# Altium schematic sheet TC1508.SchDoc
size A4; SheetNumber: 2; SheetTotal: 3
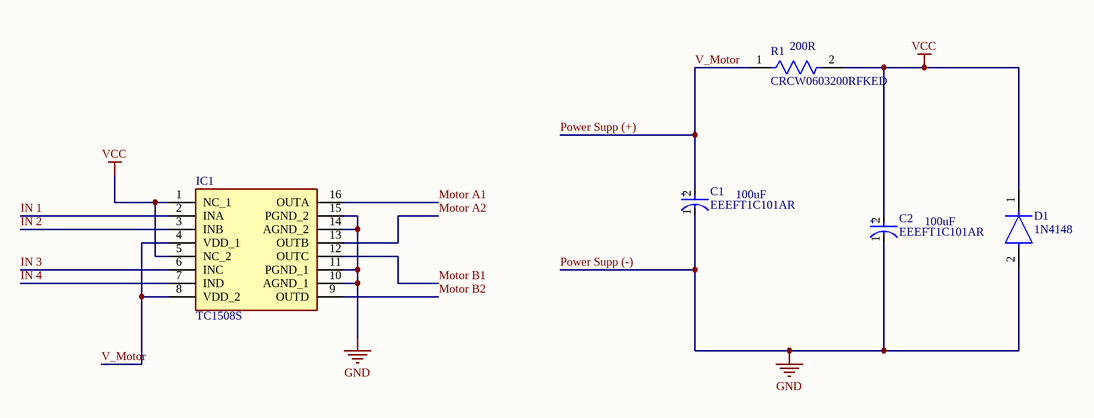
[diagram p0: TC1508.SchDoc]

## Parts
C1  EEEFT1C101AR  Capacitance: 100uF  [FP-FTC-MFG]
C2  EEEFT1C101AR  Capacitance: 100uF  [FP-FTC-MFG]
D1  1N4148  [FP-017AG-MFG]
IC1  TC1508S  [SOIC127P600X180-16N]
R1  CRCW0603200RFKED  Resistance: 200R  [FP-CRCW0603-e3-MFG]

## Nets
Power Supp (-): C1.1(C) C2.1(C) D1.2(A) IC1.10(AGND_1) IC1.11(PGND_1) IC1.14(AGND_2) IC1.15(PGND_2)  [also labelled GND]
VCC: C2.2(A) D1.1(C) IC1.1(NC_1) IC1.5(NC_2) R1.2
IN 1: IC1.2(INA)
IN 2: IC1.3(INB)
IN 3: IC1.6(INC)
IN 4: IC1.7(IND)
Motor A1: IC1.16(OUTA)
Motor A2: IC1.13(OUTB)
Motor B1: IC1.12(OUTC)
Motor B2: IC1.9(OUTD)
Power Supp (+): C1.2(A) IC1.4(VDD_1) IC1.8(VDD_2) R1.1  [also labelled V_Motor]

## Notes on the sheet
- (in symbol CMP-05427-000077-1) +

## Library data of the parts
C1 C2 = CMP-05427-000077-1: CAP ALUM 100UF 20% 16V SMD; Life (Hours): 2000Hour; Ripple Current: 240mA; Leakage Current: 16uA; Lead Diameter: 0.65mm; ESR (Equivalent Series Resistance): 360mR; Voltage Rating: 16V; Lead Pitch: 1.5mm; RoHS Compliant: Yes; Mount: Surface Mount; Tolerance: 20%; Contact Plating: Tin; Length: 5.8mm; Voltage: 16V; REACH SVHC: No SVHC; Max Operating Temperature: 105°C; Series: FT; Min Operating Temperature: -55°C; Diameter: 5mm; Case/Package: Radial; Radiation Hardening: No; Height - Seated (Max): 0.24inch; Construction: Cylindrical; Packaging: Tape and Reel; Voltage Rating (DC): 16V; Termination: SMD/SMT; Package Quantity: 1000; Ripple Current (AC): 240mA; Height: 5.8mm
D1 = CMP-07163-000046-1: DIODE GEN PURP 100V 200MA DO35; Forward Voltage: 1V; Max Power Dissipation: 500mW; Max Reverse Current: 5uA; Forward Current: 300mA; Current: 4A; Reverse Recovery Time: 4ns; Element Configuration: Single; Outside Diameter: 1.85mm; Capacitance: 4pF; Polarity: Standard; Max Forward Surge Current (Ifsm): 1A; Reverse Voltage: 100V; Output Current: 200mA; Average Rectified Current: 200mA; Diameter: 1.91mm; Max Repetitive Reverse Voltage (Vrrm): 100V; Current Rating: 200mA; Case/Package: DO-35; Lead Free: Lead Free; Number of Pins: 2; Recovery Time: 4ns; Packaging: Bulk; Contact Plating: Tin; Voltage: 100V; Mount: Through Hole; Max Surge Current: 4A; Package Quantity: 2000; Width: 1.91mm; Max Reverse Voltage (DC): 100V; Length: 4.56mm; Radiation Hardening: No; Power Dissipation: 500mW; Voltage Rating (DC): 100V; Peak Non-Repetitive Surge Current: 4A; REACH SVHC: No SVHC; Height: 4.56mm; Max Operating Temperature: 175°C; Series: -; Weight: 0.01lb; Min Operating Temperature: -65°C
IC1 = TC1508S: Integrated Circuit; Manufacturer_Name: Shenzhen Fuman Elec; Datasheet Link: https://datasheet.lcsc.com/szlcsc/2004010903_Shenzhen-Fuman-Elec-TC1508S_C89480.pdf; Height: 1.8mm; Manufacturer_Part_Number: TC1508S
R1 = CMP-02407-009572-1: RES Thick Film, 200Ω, 1%, 0.1W, 100ppm/°C, 0603; Max Power Dissipation: 100mW; Tolerance: 1%; Length: 0.061inch; Packaging: Tape and Reel; Features: Automotive AEC-Q200; Height: 0.02inch; Width: 0.033inch; Max Operating Temperature: 155°C; Min Operating Temperature: -55°C; Case/Package: 0603; Package Quantity: 10000; Temperature Coefficient: 100ppm/°C; Lead Free: Lead Free; Composition: Thick Film; Number of Terminations: 2